# EAGLE schematic UNI_1_1 (EAGLE 8.3.2)
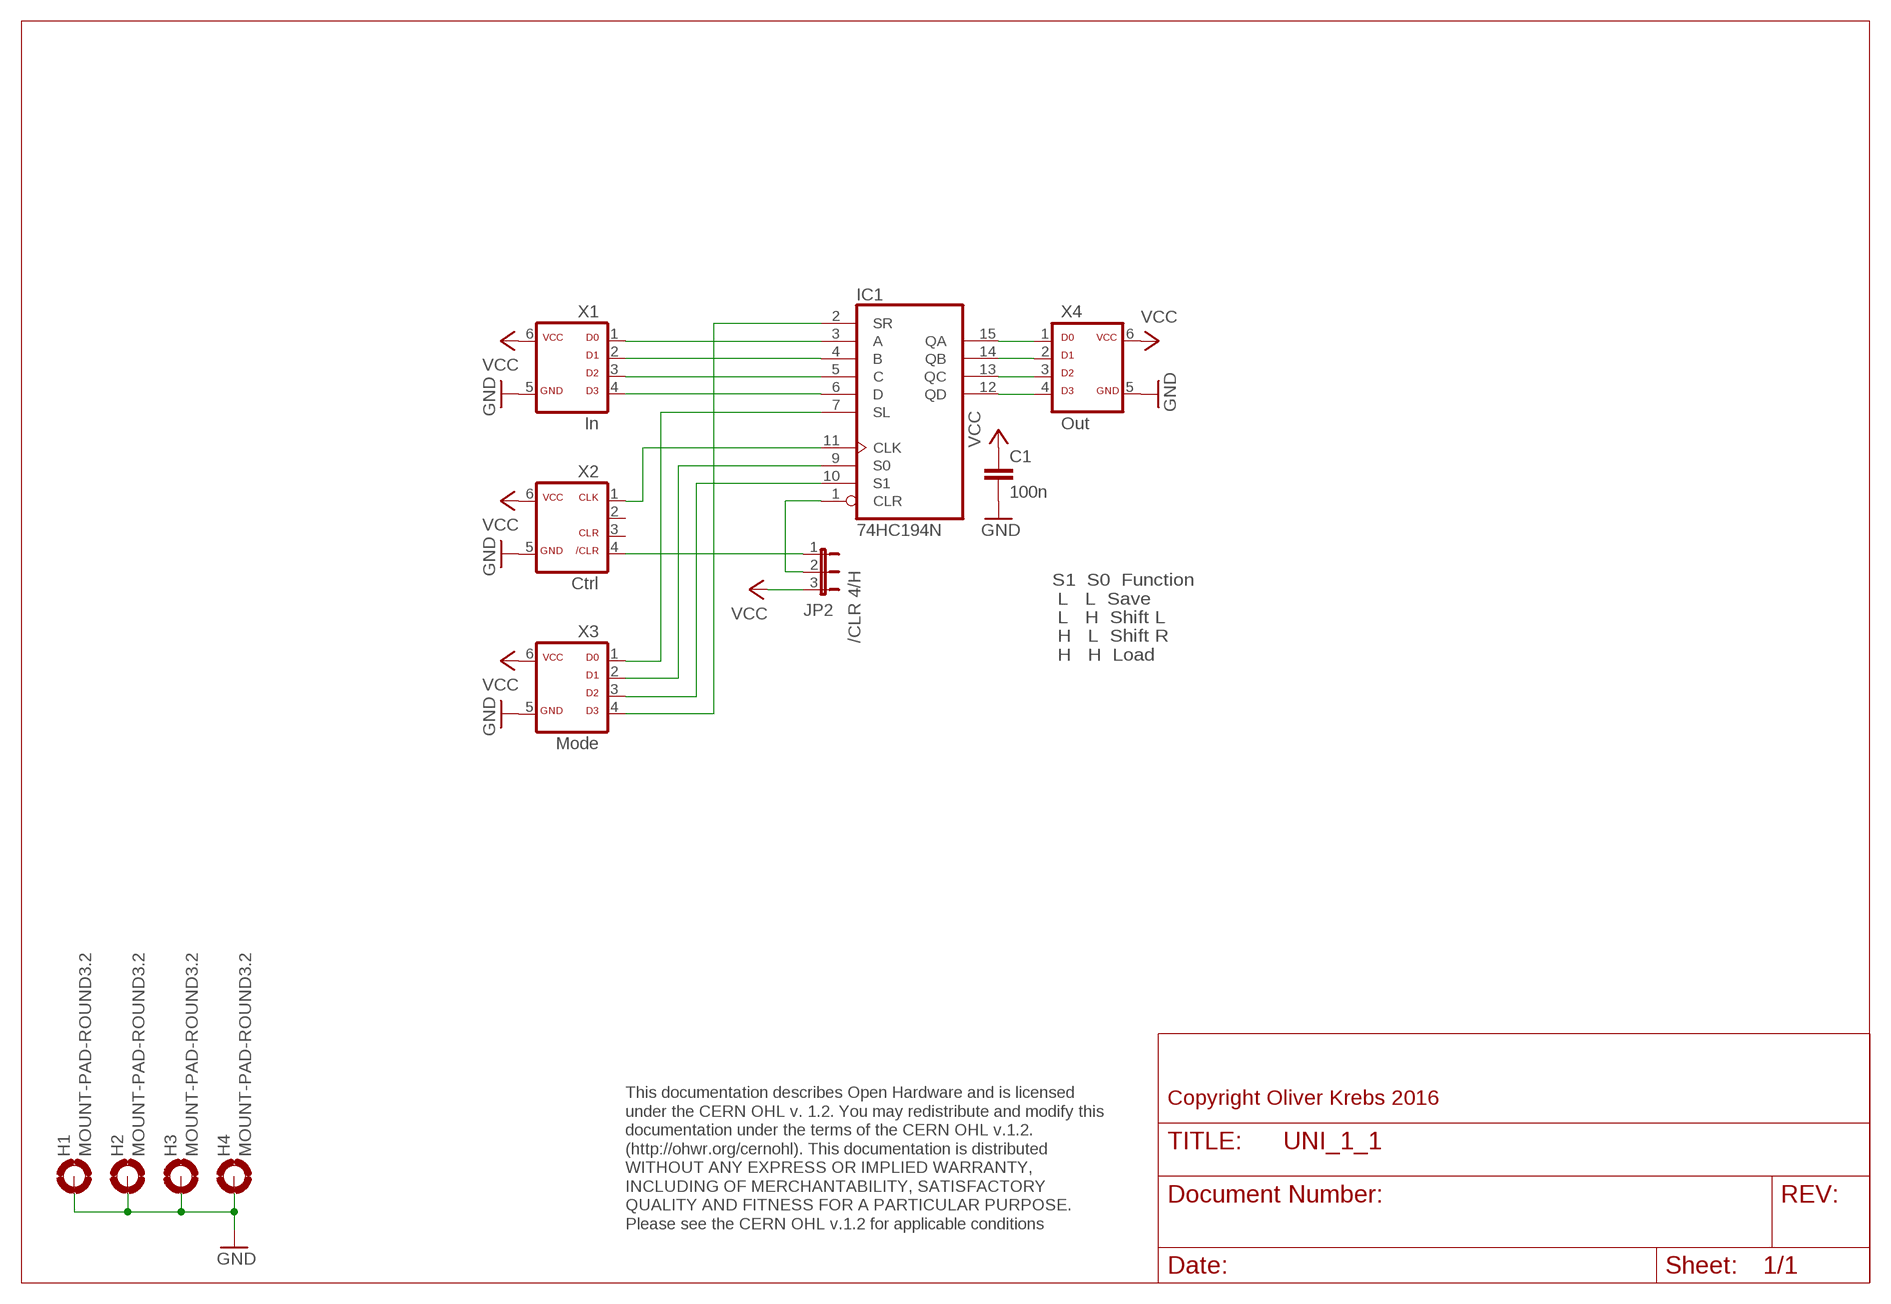
[diagram p0: schematic, sheet 1]

## Parts
C1  100n  C-EU050-025X075  [C050-025X075]
H1  MOUNT-PAD-ROUND3.2  [3,2-PAD]
H2  MOUNT-PAD-ROUND3.2  [3,2-PAD]
H3  MOUNT-PAD-ROUND3.2  [3,2-PAD]
H4  MOUNT-PAD-ROUND3.2  [3,2-PAD]
IC1  74HC194N  [DIL16]
JP2  /CLR 4/H  JP2E  [JP2]
X1  In  ML6D  [ML-6]
X2  Ctrl  ML6C  [ML-6]
X3  Mode  ML6D  [ML-6]
X4  Out  ML6D  [ML-6]

## Nets
GND: C1.2 H1.B3,2(MOUNT) H2.B3,2(MOUNT) H3.B3,2(MOUNT) H4.B3,2(MOUNT) X1.5 X2.5 X3.5 X4.5
N$1: IC1.3(A) X1.1
N$2: IC1.4(B) X1.2
N$3: IC1.5(C) X1.3
N$4: IC1.6(D) X1.4
N$5: IC1.11(CLK) X2.1
N$6: IC1.1(CLR) JP2.2
N$7: IC1.15(QA) X4.1
N$8: IC1.14(QB) X4.2
N$9: IC1.13(QC) X4.3
N$10: IC1.12(QD) X4.4
N$11: IC1.9(S0) X3.2
N$12: IC1.2(SR) X3.4
N$15: JP2.1 X2.4
N$16: IC1.10(S1) X3.3
N$17: IC1.7(SL) X3.1
VCC: C1.1 JP2.3 X1.6 X2.6 X3.6 X4.6
Unconnected: X2.2 X2.3

## Notes on the sheet
- S1  S0  Function
   L   L  Save
   L   H  Shift L
   H   L  Shift R
   H   H  Load
- Copyright Oliver Krebs 2016
- This documentation describes Open Hardware and is licensed 
  under the CERN OHL v. 1.2. You may redistribute and modify this 
  documentation under the terms of the CERN OHL v.1.2. 
  (http://ohwr.org/cernohl). This documentation is distributed
  WITHOUT ANY EXPRESS OR IMPLIED WARRANTY, 
  INCLUDING OF MERCHANTABILITY, SATISFACTORY 
  QUALITY AND FITNESS FOR A PARTICULAR PURPOSE. 
  Please see the CERN OHL v.1.2 for applicable conditions

## Power pins joined to a net without a drawn wire
GND: IC1.8(GND)
VCC: IC1.16(VCC)

## Library data of the parts
C1 = 01-my_rcl:C-EU: CAPACITOR, European symbol
H1-H4 = holes:MOUNT-PAD-ROUND: MOUNTING PAD, round
IC1 = 74xx-eu:74*194: 4-bit bidirectional SHIFT REGISTER
JP2 = jumper:JP2E: JUMPER
X1 X3 X4 = 01-my-con:ML6D
X2 = 01-my-con:ML6C